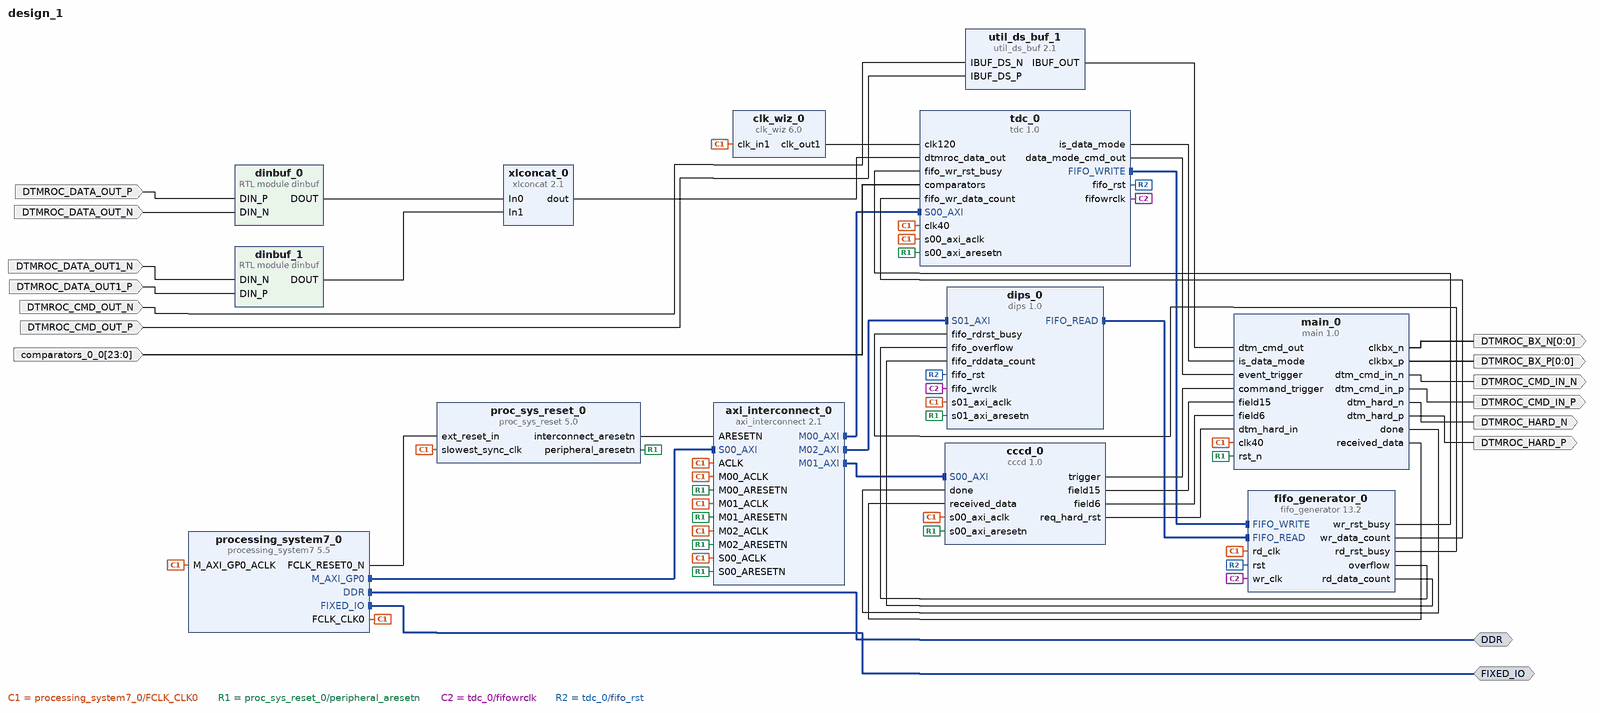
[diagram p0: block diagram of the top level]
# Vivado block design design_1, xc7z010clg400-1, Vivado 2018.1
create_bd_design design_1

create_bd_intf_port -mode Master -vlnv xilinx.com:interface:ddrx_rtl:1.0 DDR
create_bd_intf_port -mode Master -vlnv xilinx.com:display_processing_system7:fixedio_rtl:1.0 FIXED_IO
create_bd_port -dir I DTMROC_CMD_OUT_N
create_bd_port -dir I DTMROC_CMD_OUT_P
create_bd_port -dir O DTMROC_CMD_IN_N
create_bd_port -dir O -from 0 -to 0 -type clk DTMROC_BX_P
create_bd_port -dir O -from 0 -to 0 -type clk DTMROC_BX_N
create_bd_port -dir O DTMROC_HARD_P
create_bd_port -dir O DTMROC_HARD_N
create_bd_port -dir O DTMROC_CMD_IN_P
create_bd_port -dir I -from 23 -to 0 comparators_0_0
create_bd_port -dir I DTMROC_DATA_OUT_P
create_bd_port -dir I DTMROC_DATA_OUT_N
create_bd_port -dir I DTMROC_DATA_OUT1_P
create_bd_port -dir I DTMROC_DATA_OUT1_N

create_bd_cell -type ip -vlnv xilinx.com:ip:processing_system7:5.5 processing_system7_0
set_property -dict [list \
  CONFIG.PCW_APU_PERIPHERAL_FREQMHZ 667 \
  CONFIG.PCW_SDIO_PERIPHERAL_FREQMHZ 25 \
  CONFIG.PCW_UART_PERIPHERAL_FREQMHZ 50 \
  CONFIG.PCW_FPGA0_PERIPHERAL_FREQMHZ 40 \
  CONFIG.PCW_FPGA1_PERIPHERAL_FREQMHZ 100 \
  CONFIG.PCW_FPGA2_PERIPHERAL_FREQMHZ 33.333333 \
  CONFIG.PCW_PRESET_BANK1_VOLTAGE {LVCMOS 1.8V} \
  CONFIG.PCW_UIPARAM_DDR_PARTNO {MT41K256M16 RE-125} \
  CONFIG.PCW_QSPI_PERIPHERAL_ENABLE 1 \
  CONFIG.PCW_QSPI_QSPI_IO {MIO 1 .. 6} \
  CONFIG.PCW_QSPI_GRP_SINGLE_SS_ENABLE 1 \
  CONFIG.PCW_QSPI_GRP_SINGLE_SS_IO {MIO 1 .. 6} \
  CONFIG.PCW_SINGLE_QSPI_DATA_MODE x4 \
  CONFIG.PCW_QSPI_GRP_FBCLK_ENABLE 1 \
  CONFIG.PCW_QSPI_GRP_FBCLK_IO {MIO 8} \
  CONFIG.PCW_ENET0_PERIPHERAL_ENABLE 1 \
  CONFIG.PCW_ENET0_ENET0_IO {MIO 16 .. 27} \
  CONFIG.PCW_ENET0_GRP_MDIO_ENABLE 1 \
  CONFIG.PCW_ENET0_GRP_MDIO_IO {MIO 52 .. 53} \
  CONFIG.PCW_ENET_RESET_ENABLE 1 \
  CONFIG.PCW_ENET_RESET_SELECT {Share reset pin} \
  CONFIG.PCW_ENET0_RESET_ENABLE 0 \
  CONFIG.PCW_SD0_PERIPHERAL_ENABLE 1 \
  CONFIG.PCW_SD0_SD0_IO {MIO 40 .. 45} \
  CONFIG.PCW_SD0_GRP_CD_ENABLE 1 \
  CONFIG.PCW_SD0_GRP_CD_IO {MIO 46} \
  CONFIG.PCW_SD0_GRP_WP_ENABLE 1 \
  CONFIG.PCW_SD0_GRP_WP_IO {MIO 50} \
  CONFIG.PCW_UART1_PERIPHERAL_ENABLE 1 \
  CONFIG.PCW_UART1_UART1_IO {MIO 48 .. 49} \
  CONFIG.PCW_TTC0_PERIPHERAL_ENABLE 1 \
  CONFIG.PCW_TTC0_TTC0_IO EMIO \
  CONFIG.PCW_USB0_PERIPHERAL_ENABLE 1 \
  CONFIG.PCW_USB0_USB0_IO {MIO 28 .. 39} \
  CONFIG.PCW_USB_RESET_ENABLE 1 \
  CONFIG.PCW_USB_RESET_SELECT {Share reset pin} \
  CONFIG.PCW_USB0_RESET_ENABLE 1 \
  CONFIG.PCW_USB0_RESET_IO {MIO 7} \
  CONFIG.PCW_I2C_RESET_ENABLE 0 \
  CONFIG.PCW_GPIO_PERIPHERAL_ENABLE 1 \
  CONFIG.PCW_GPIO_MIO_GPIO_ENABLE 1 \
  CONFIG.PCW_GPIO_MIO_GPIO_IO MIO \
] [get_bd_cells processing_system7_0]
# 277 more settings of processing_system7_0 are not shown: defaults, MIO pin electricals, DDR timing, and values the tool derives
create_bd_cell -type ip -vlnv xilinx.com:ip:proc_sys_reset:5.0 proc_sys_reset_0
create_bd_cell -type ip -vlnv xilinx.com:ip:util_ds_buf:2.1 util_ds_buf_1
create_bd_cell -type ip -vlnv xilinx.com:ip:axi_interconnect:2.1 axi_interconnect_0
set_property -dict {CONFIG.NUM_SI 1 CONFIG.NUM_MI 3 CONFIG.ENABLE_ADVANCED_OPTIONS 0} [get_bd_cells axi_interconnect_0]
create_bd_cell -type ip -vlnv xilinx.com:ip:clk_wiz:6.0 clk_wiz_0
set_property -dict [list \
  CONFIG.PRIM_IN_FREQ 40 \
  CONFIG.JITTER_OPTIONS PS \
  CONFIG.CLKIN1_UI_JITTER 100.000 \
  CONFIG.CLKIN2_UI_JITTER 100.000 \
  CONFIG.CLKIN1_JITTER_PS 100.000 \
  CONFIG.CLKIN2_JITTER_PS 100.000 \
  CONFIG.CLKOUT2_USED false \
  CONFIG.NUM_OUT_CLKS 1 \
  CONFIG.CLKOUT1_REQUESTED_OUT_FREQ 120 \
  CONFIG.USE_LOCKED false \
  CONFIG.USE_RESET false \
  CONFIG.MMCM_DIVCLK_DIVIDE 1 \
  CONFIG.MMCM_CLKFBOUT_MULT_F 25.125 \
  CONFIG.MMCM_CLKIN1_PERIOD 25.000 \
  CONFIG.MMCM_CLKIN2_PERIOD 10.0 \
  CONFIG.MMCM_REF_JITTER1 0.004 \
  CONFIG.MMCM_REF_JITTER2 0.010 \
  CONFIG.MMCM_CLKOUT0_DIVIDE_F 8.375 \
  CONFIG.MMCM_CLKOUT1_DIVIDE 1 \
  CONFIG.CLKOUT1_JITTER 164.670 \
  CONFIG.CLKOUT1_PHASE_ERROR 190.896 \
  CONFIG.CLKOUT2_JITTER 130.958 \
  CONFIG.CLKOUT2_PHASE_ERROR 98.575 \
] [get_bd_cells clk_wiz_0]
create_bd_cell -type ip -vlnv xilinx.com:user:main:1.0 main_0
create_bd_cell -type ip -vlnv xilinx.com:user:cccd:1.0 cccd_0
create_bd_cell -type ip -vlnv xilinx.com:ip:xlconcat:2.1 xlconcat_0
create_bd_cell -type ip -vlnv xilinx.com:ip:fifo_generator:13.2 fifo_generator_0
set_property -dict [list \
  CONFIG.Fifo_Implementation Independent_Clocks_Block_RAM \
  CONFIG.INTERFACE_TYPE Native \
  CONFIG.Performance_Options First_Word_Fall_Through \
  CONFIG.Input_Data_Width 16 \
  CONFIG.Input_Depth 65536 \
  CONFIG.Output_Data_Width 32 \
  CONFIG.Use_Embedded_Registers false \
  CONFIG.Reset_Pin true \
  CONFIG.Full_Flags_Reset_Value 0 \
  CONFIG.Use_Dout_Reset true \
  CONFIG.Dout_Reset_Value deadbabe \
  CONFIG.Almost_Full_Flag false \
  CONFIG.Overflow_Flag true \
  CONFIG.Write_Data_Count true \
  CONFIG.Write_Data_Count_Width 16 \
  CONFIG.Read_Data_Count true \
  CONFIG.Read_Data_Count_Width 15 \
  CONFIG.Programmable_Full_Type No_Programmable_Full_Threshold \
  CONFIG.Enable_Safety_Circuit true \
] [get_bd_cells fifo_generator_0]
create_bd_cell -type module -reference dinbuf dinbuf_0
create_bd_cell -type module -reference dinbuf dinbuf_1
create_bd_cell -type ip -vlnv xilinx.com:user:dips:1.0 dips_0
create_bd_cell -type ip -vlnv xilinx.com:user:tdc:1.0 tdc_0

# ---- connections ----

connect_bd_intf_net [get_bd_intf_pins processing_system7_0/M_AXI_GP0] [get_bd_intf_pins axi_interconnect_0/S00_AXI]
connect_bd_intf_net [get_bd_intf_pins axi_interconnect_0/M01_AXI] [get_bd_intf_pins cccd_0/S00_AXI]
connect_bd_intf_net [get_bd_intf_pins axi_interconnect_0/M00_AXI] [get_bd_intf_pins tdc_0/S00_AXI]
connect_bd_intf_net [get_bd_intf_pins tdc_0/FIFO_WRITE] [get_bd_intf_pins fifo_generator_0/FIFO_WRITE]
connect_bd_intf_net [get_bd_intf_pins dips_0/S01_AXI] [get_bd_intf_pins axi_interconnect_0/M02_AXI]
connect_bd_intf_net [get_bd_intf_pins dips_0/FIFO_READ] [get_bd_intf_pins fifo_generator_0/FIFO_READ]
connect_bd_intf_net [get_bd_intf_ports DDR] [get_bd_intf_pins processing_system7_0/DDR]
connect_bd_intf_net [get_bd_intf_ports FIXED_IO] [get_bd_intf_pins processing_system7_0/FIXED_IO]
connect_bd_net [get_bd_pins processing_system7_0/FCLK_CLK0] \
  [get_bd_pins proc_sys_reset_0/slowest_sync_clk] [get_bd_pins processing_system7_0/M_AXI_GP0_ACLK] \
  [get_bd_pins clk_wiz_0/clk_in1] [get_bd_pins main_0/clk40] [get_bd_pins cccd_0/s00_axi_aclk] \
  [get_bd_pins axi_interconnect_0/ACLK] [get_bd_pins axi_interconnect_0/S00_ACLK] [get_bd_pins axi_interconnect_0/M00_ACLK] \
  [get_bd_pins axi_interconnect_0/M01_ACLK] [get_bd_pins axi_interconnect_0/M02_ACLK] [get_bd_pins fifo_generator_0/rd_clk] \
  [get_bd_pins dips_0/s01_axi_aclk] [get_bd_pins tdc_0/clk40] [get_bd_pins tdc_0/s00_axi_aclk]
connect_bd_net [get_bd_ports DTMROC_CMD_OUT_N] [get_bd_pins util_ds_buf_1/IBUF_DS_N]
connect_bd_net [get_bd_ports DTMROC_CMD_OUT_P] [get_bd_pins util_ds_buf_1/IBUF_DS_P]
connect_bd_net [get_bd_pins main_0/dtm_cmd_in_n] [get_bd_ports DTMROC_CMD_IN_N]
connect_bd_net [get_bd_pins main_0/clkbx_p] [get_bd_ports DTMROC_BX_P]
connect_bd_net [get_bd_pins main_0/clkbx_n] [get_bd_ports DTMROC_BX_N]
connect_bd_net [get_bd_pins main_0/dtm_hard_p] [get_bd_ports DTMROC_HARD_P]
connect_bd_net [get_bd_pins main_0/dtm_hard_n] [get_bd_ports DTMROC_HARD_N]
connect_bd_net [get_bd_pins util_ds_buf_1/IBUF_OUT] [get_bd_pins main_0/dtm_cmd_out]
connect_bd_net [get_bd_pins proc_sys_reset_0/peripheral_aresetn] \
  [get_bd_pins main_0/rst_n] [get_bd_pins cccd_0/s00_axi_aresetn] [get_bd_pins axi_interconnect_0/S00_ARESETN] \
  [get_bd_pins axi_interconnect_0/M00_ARESETN] [get_bd_pins axi_interconnect_0/M01_ARESETN] \
  [get_bd_pins axi_interconnect_0/M02_ARESETN] [get_bd_pins dips_0/s01_axi_aresetn] [get_bd_pins tdc_0/s00_axi_aresetn]
connect_bd_net [get_bd_pins proc_sys_reset_0/interconnect_aresetn] [get_bd_pins axi_interconnect_0/ARESETN]
connect_bd_net [get_bd_pins cccd_0/trigger] [get_bd_pins main_0/command_trigger]
connect_bd_net [get_bd_pins cccd_0/field15] [get_bd_pins main_0/field15]
connect_bd_net [get_bd_pins main_0/done] [get_bd_pins cccd_0/done]
connect_bd_net [get_bd_pins main_0/received_data] [get_bd_pins cccd_0/received_data]
connect_bd_net [get_bd_pins cccd_0/field6] [get_bd_pins main_0/field6]
connect_bd_net [get_bd_pins main_0/dtm_cmd_in_p] [get_bd_ports DTMROC_CMD_IN_P]
connect_bd_net [get_bd_pins tdc_0/is_data_mode] [get_bd_pins main_0/is_data_mode]
connect_bd_net -net tdc_0_data_mode_cmd [get_bd_pins tdc_0/data_mode_cmd_out] [get_bd_pins main_0/event_trigger]
connect_bd_net -net comparators_0_0_1 [get_bd_ports comparators_0_0] [get_bd_pins tdc_0/comparators]
connect_bd_net [get_bd_pins clk_wiz_0/clk_out1] [get_bd_pins tdc_0/clk120]
connect_bd_net [get_bd_pins cccd_0/req_hard_rst] [get_bd_pins main_0/dtm_hard_in]
connect_bd_net [get_bd_pins xlconcat_0/dout] [get_bd_pins tdc_0/dtmroc_data_out]
connect_bd_net [get_bd_pins tdc_0/fifowrclk] [get_bd_pins fifo_generator_0/wr_clk] [get_bd_pins dips_0/fifo_wrclk]
connect_bd_net [get_bd_pins processing_system7_0/FCLK_RESET0_N] [get_bd_pins proc_sys_reset_0/ext_reset_in]
connect_bd_net [get_bd_pins tdc_0/fifo_rst] [get_bd_pins fifo_generator_0/rst] [get_bd_pins dips_0/fifo_rst]
connect_bd_net [get_bd_pins fifo_generator_0/wr_rst_busy] [get_bd_pins tdc_0/fifo_wr_rst_busy]
connect_bd_net [get_bd_pins fifo_generator_0/rd_rst_busy] [get_bd_pins dips_0/fifo_rdrst_busy]
connect_bd_net [get_bd_ports DTMROC_DATA_OUT_P] [get_bd_pins dinbuf_0/DIN_P]
connect_bd_net [get_bd_ports DTMROC_DATA_OUT_N] [get_bd_pins dinbuf_0/DIN_N]
connect_bd_net [get_bd_ports DTMROC_DATA_OUT1_N] [get_bd_pins dinbuf_1/DIN_N]
connect_bd_net [get_bd_ports DTMROC_DATA_OUT1_P] [get_bd_pins dinbuf_1/DIN_P]
connect_bd_net [get_bd_pins dinbuf_1/DOUT] [get_bd_pins xlconcat_0/In1]
connect_bd_net [get_bd_pins dinbuf_0/DOUT] [get_bd_pins xlconcat_0/In0]
connect_bd_net [get_bd_pins fifo_generator_0/wr_data_count] [get_bd_pins tdc_0/fifo_wr_data_count]
connect_bd_net [get_bd_pins fifo_generator_0/overflow] [get_bd_pins dips_0/fifo_overflow]
connect_bd_net [get_bd_pins fifo_generator_0/rd_data_count] [get_bd_pins dips_0/fifo_rddata_count]

# ---- address map ----
assign_bd_address -offset 0x43C00000 -range 64K -target_address_space [get_bd_addr_spaces processing_system7_0/Data] [get_bd_addr_segs cccd_0/S00_AXI/S00_AXI_reg]
assign_bd_address -offset 0x43C10000 -range 64K -target_address_space [get_bd_addr_spaces processing_system7_0/Data] [get_bd_addr_segs tdc_0/S00_AXI/S00_AXI_reg]
assign_bd_address -offset 0x43C20000 -range 64K -target_address_space [get_bd_addr_spaces processing_system7_0/Data] [get_bd_addr_segs dips_0/S01_AXI/S01_AXI_reg]

validate_bd_design
save_bd_design
